# Altium schematic sheet 03-TESTER_CONFIG.SchDoc
size 594 x 420 mm
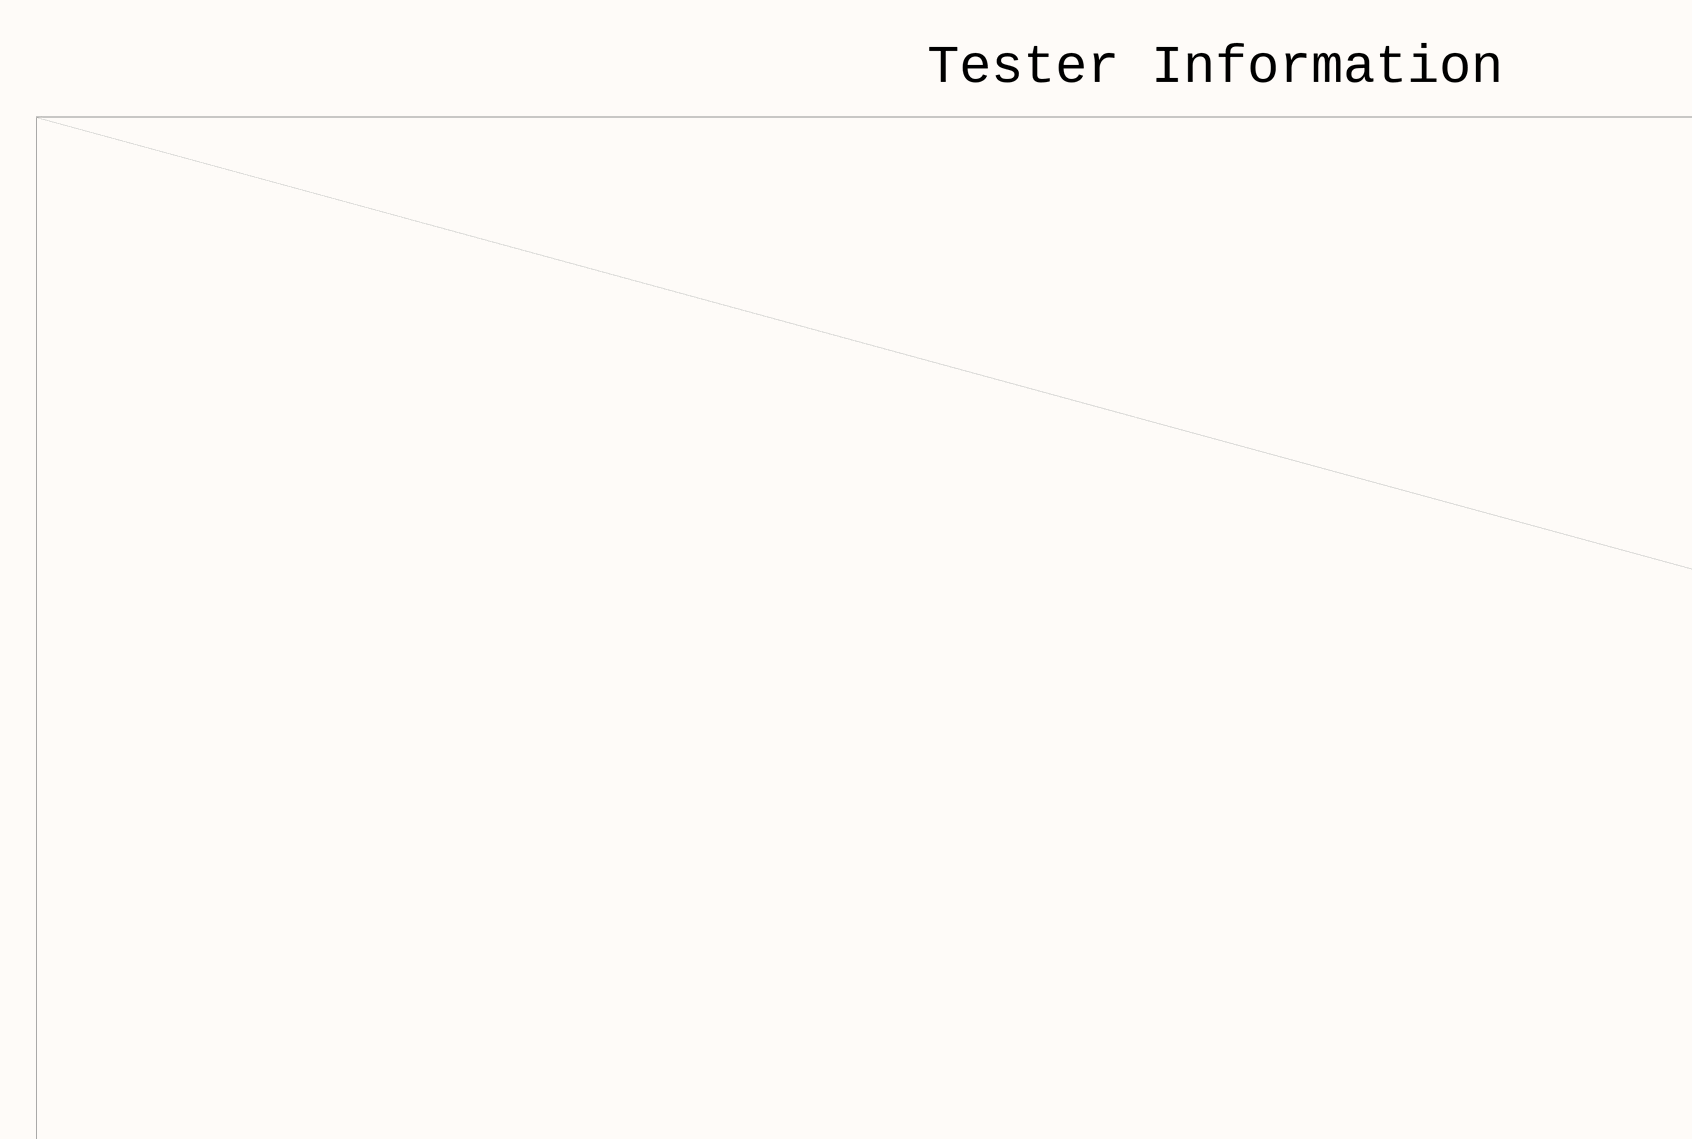
[diagram p0: 03-TESTER_CONFIG.SchDoc, top column 1 of 4]
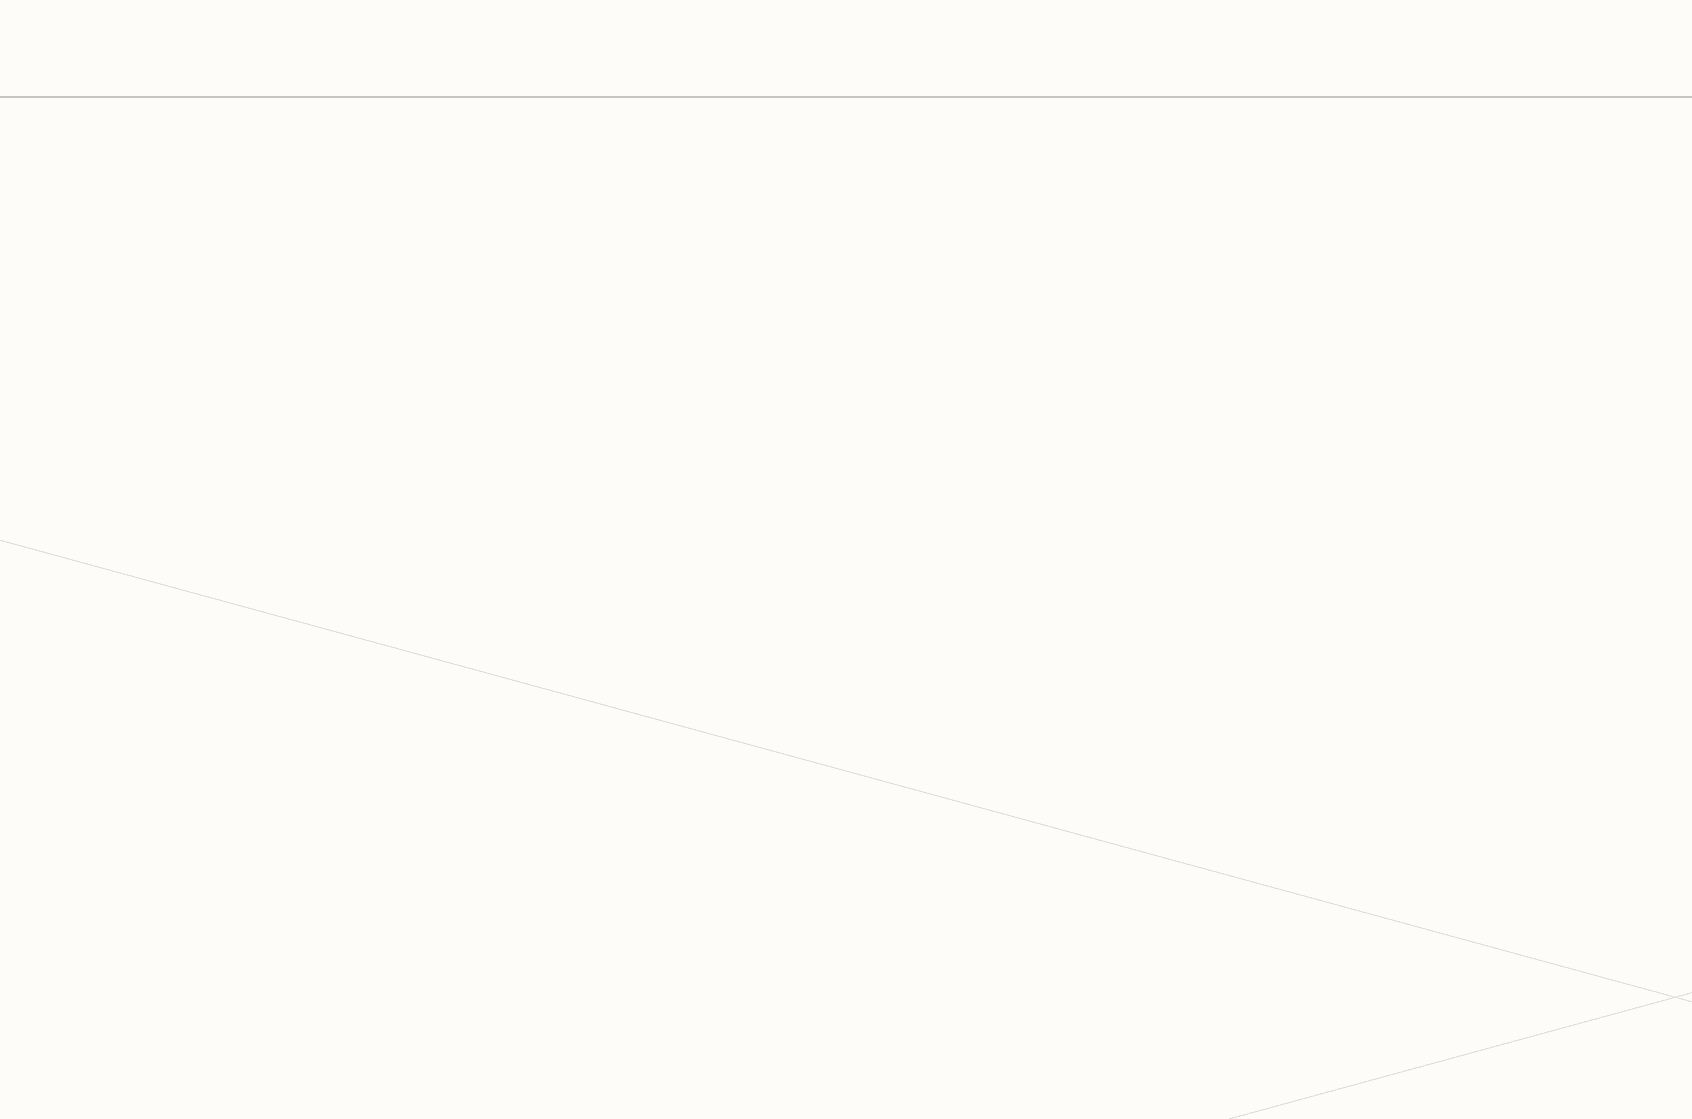
[diagram p1: 03-TESTER_CONFIG.SchDoc, top column 2 of 4]
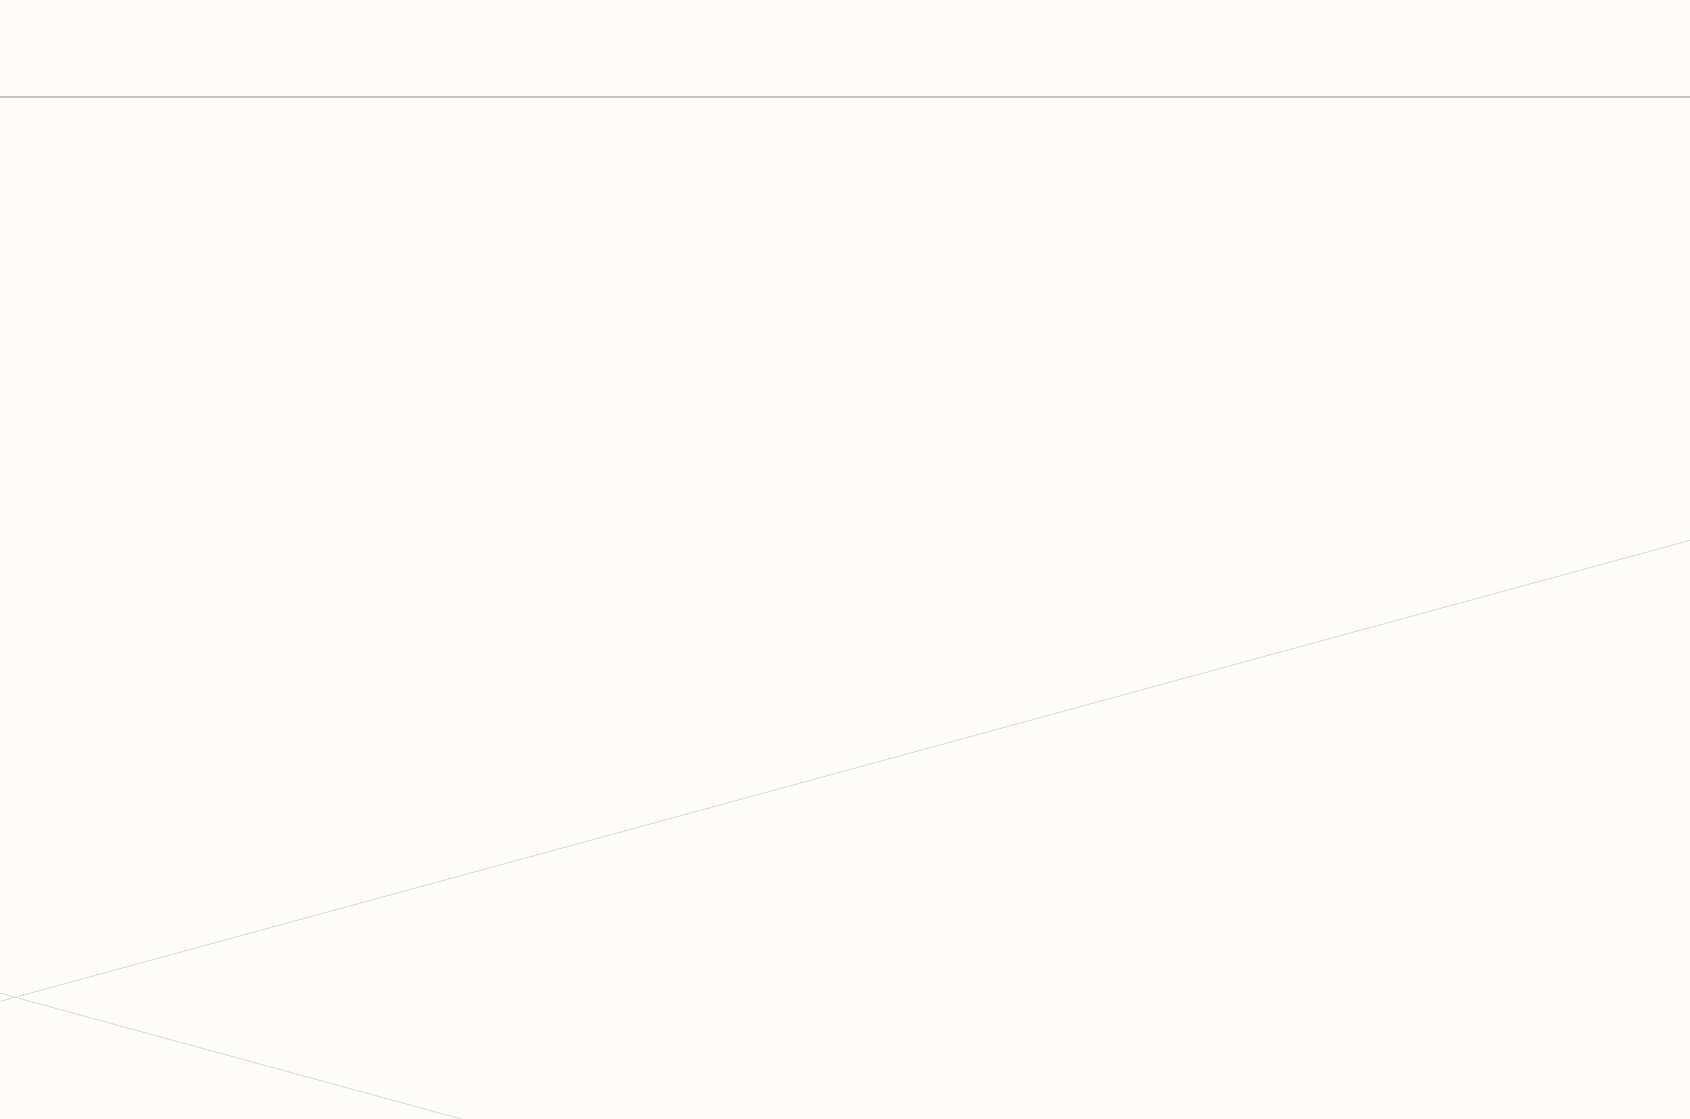
[diagram p2: 03-TESTER_CONFIG.SchDoc, top column 3 of 4]
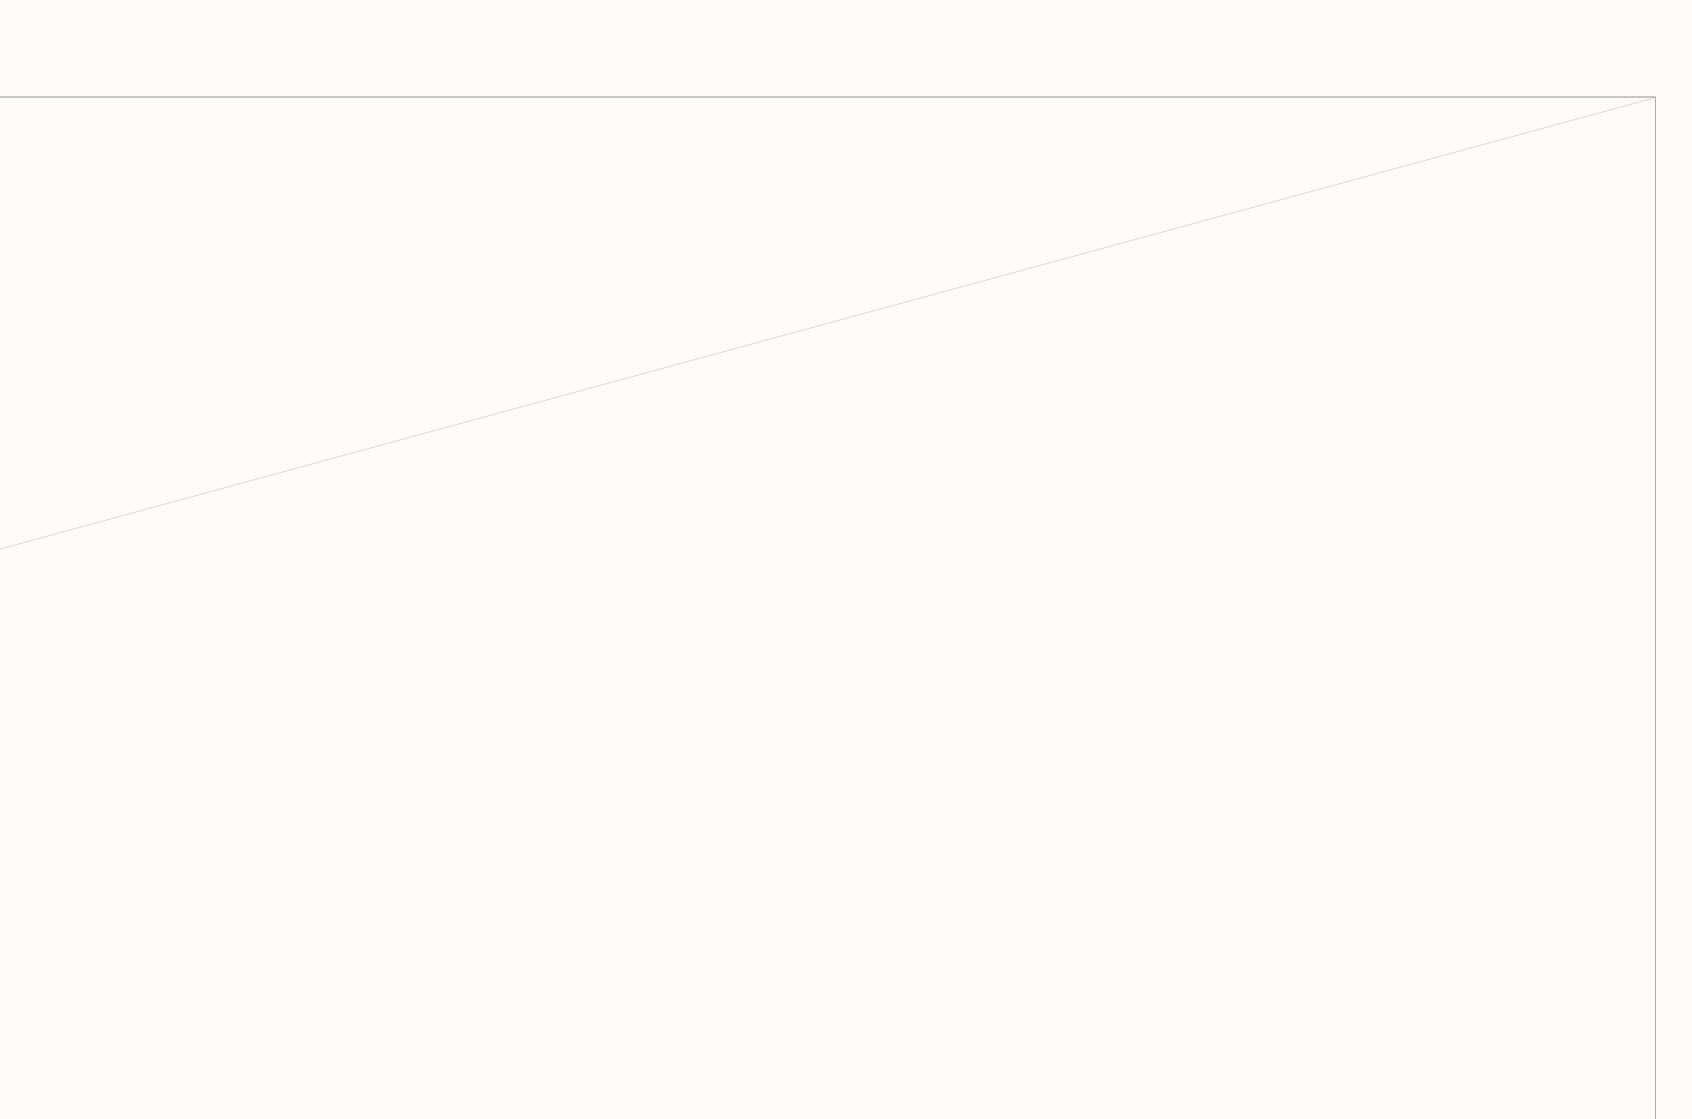
[diagram p3: 03-TESTER_CONFIG.SchDoc, top column 4 of 4]
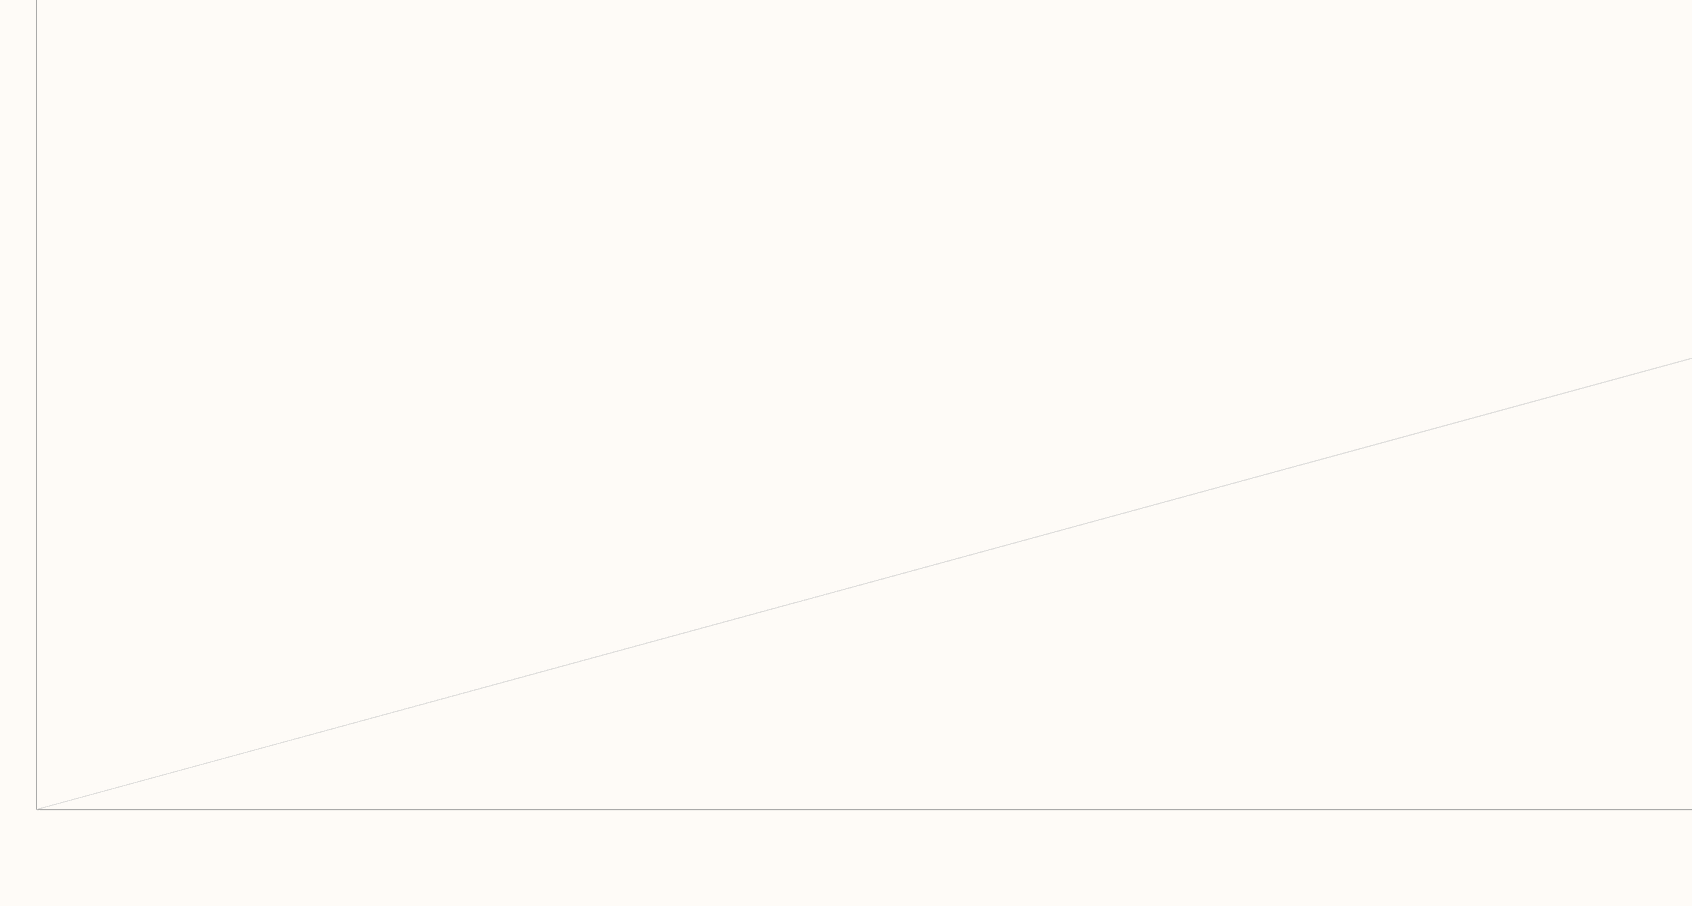
[diagram p4: 03-TESTER_CONFIG.SchDoc, bottom column 1 of 4]
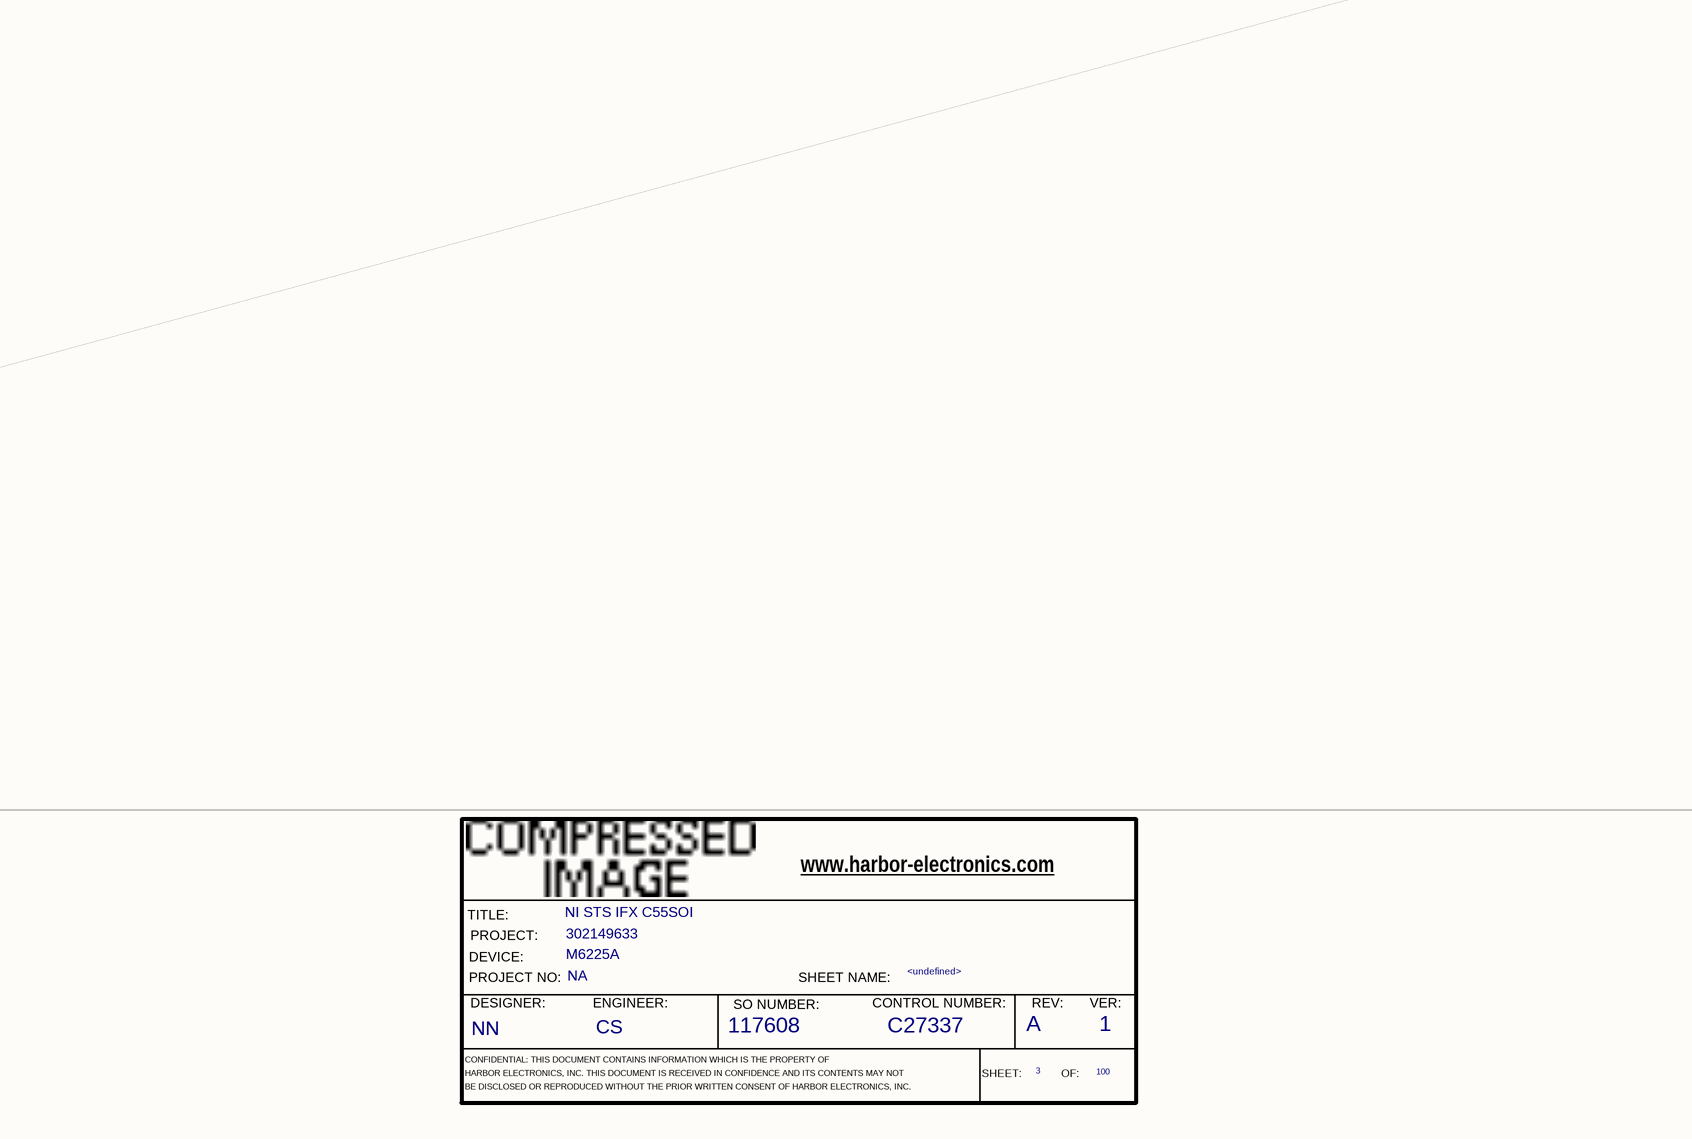
[diagram p5: 03-TESTER_CONFIG.SchDoc, bottom column 2 of 4]
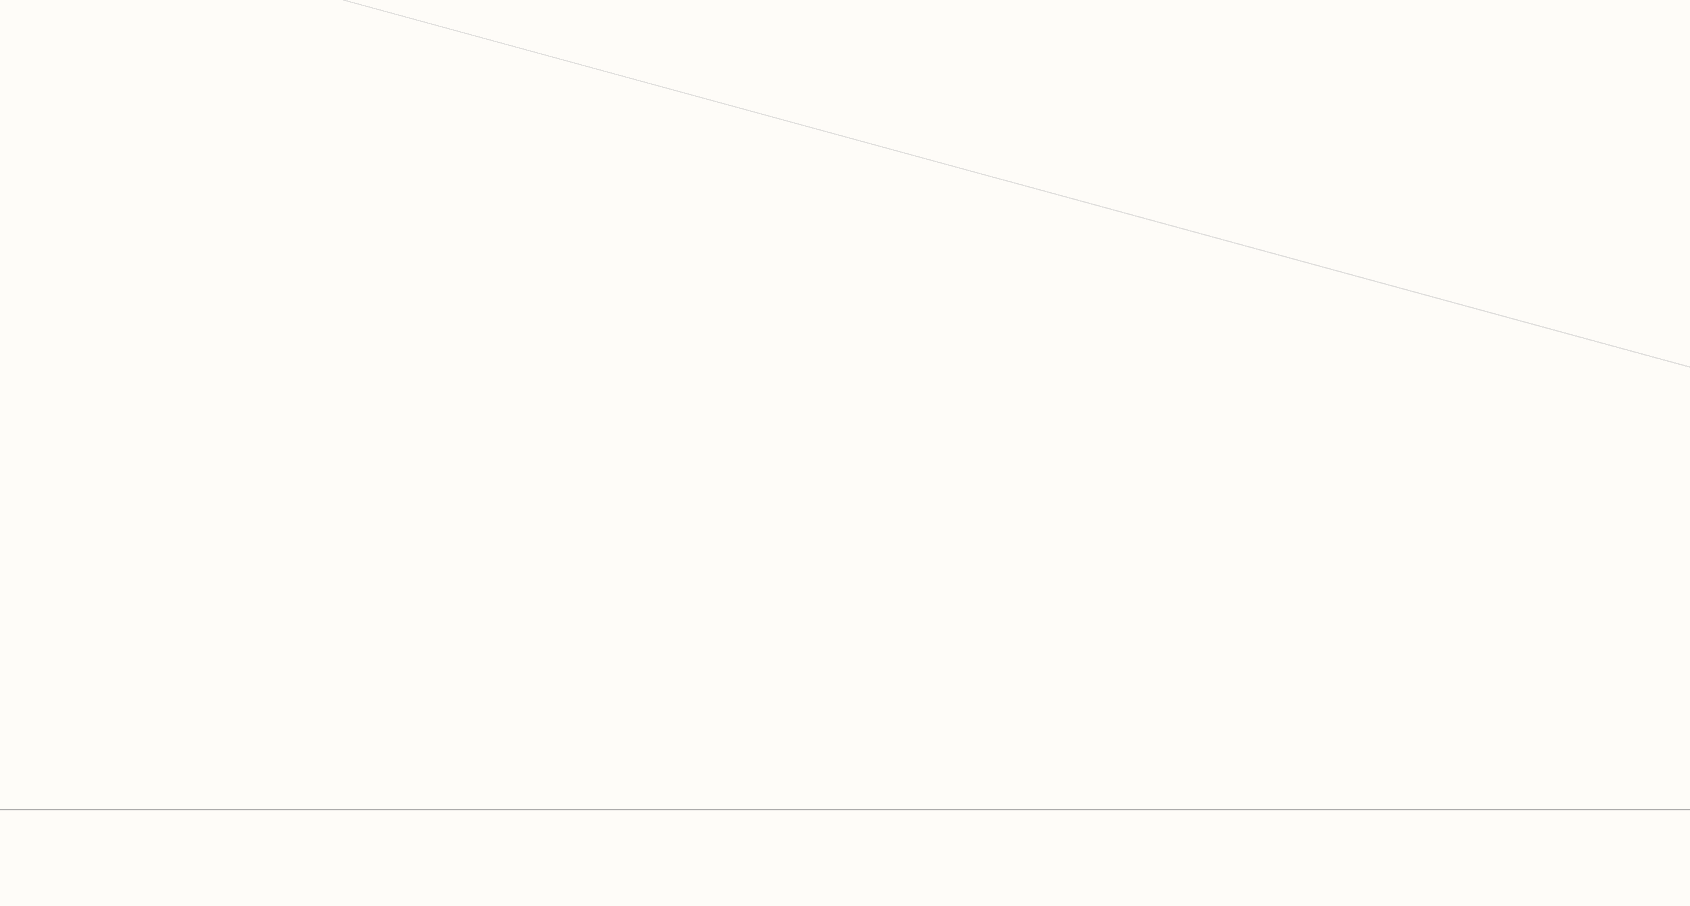
[diagram p6: 03-TESTER_CONFIG.SchDoc, bottom column 3 of 4]
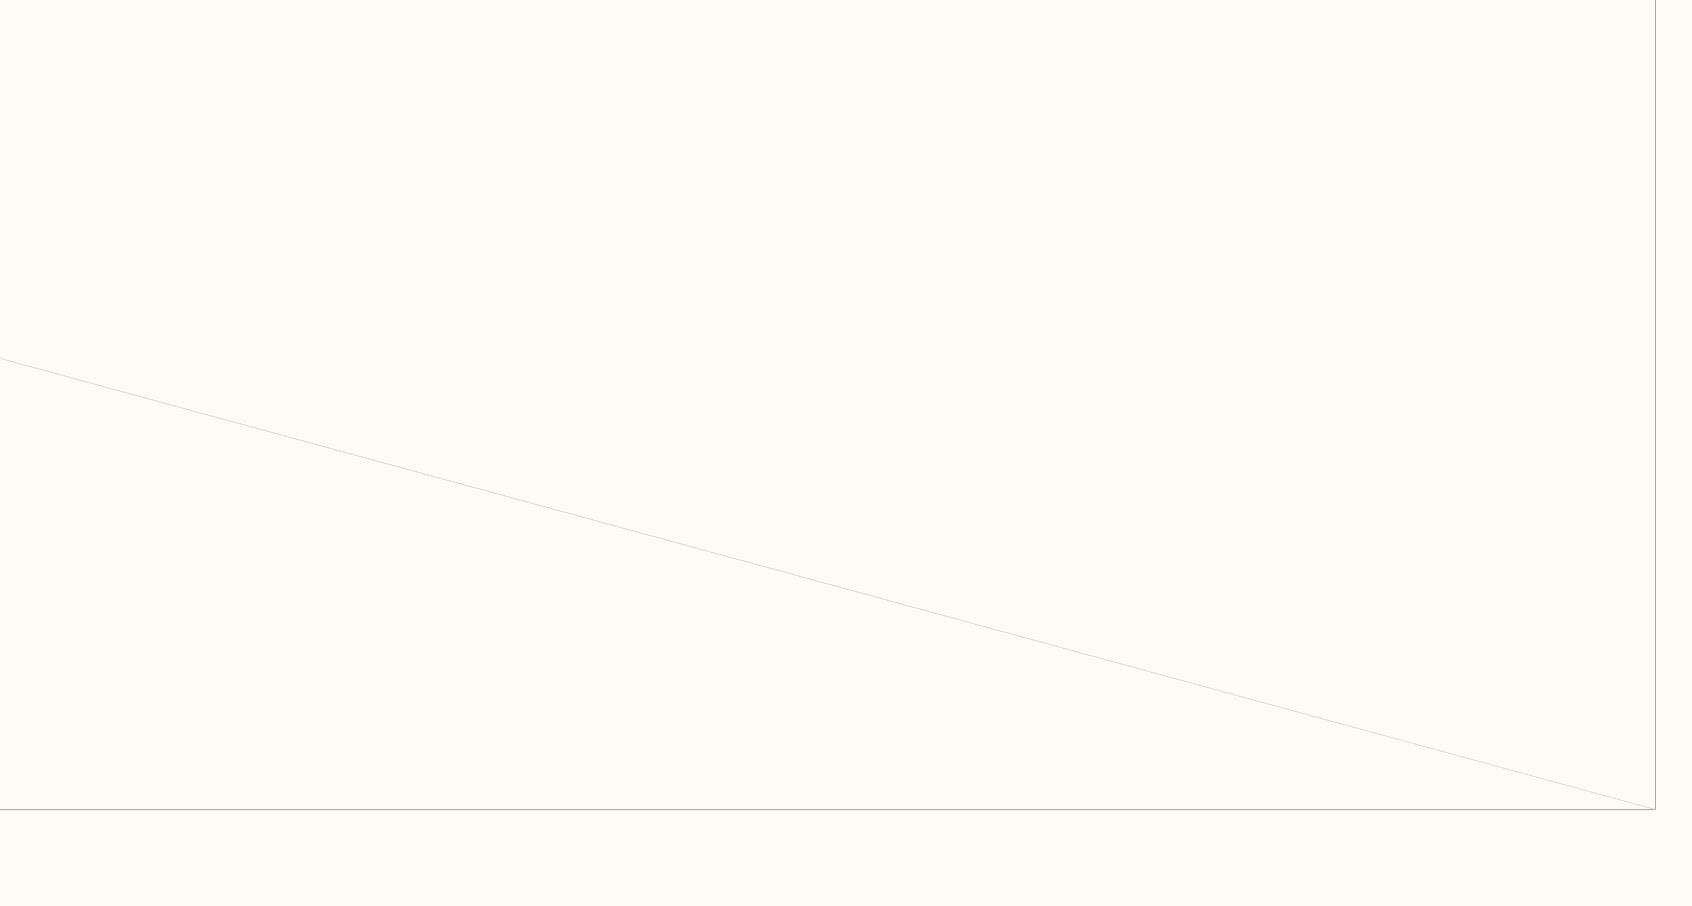
[diagram p7: 03-TESTER_CONFIG.SchDoc, bottom column 4 of 4]

## Parts
*  RevCode: A  Title: NI STS IFX C55SOI  Page Number: 3  Page Count: 100  Engineer: CS  Designer: NN  SO Number: 117608  Control Number: C27337  Version: 1  Page Name: <undefined>  PROJECT: 302149633  DEVICE: M6225A  PROJECT NO.: NA  (hidden comment: HE_DEFAULT)  (graphical)

## Notes on the sheet
- Tester Information
- (in symbol HE_DEFAULT) www.harbor-electronics.com; TITLE:; PROJECT:; DEVICE:; PROJECT NO:; SHEET NAME:; DESIGNER:; ENGINEER:; SO NUMBER:; CONTROL NUMBER:; REV:; VER:; CONFIDENTIAL: THIS DOCUMENT CONTAINS INFORMATION WHICH IS THE PROPERTY OF; HARBOR ELECTRONICS, INC. THIS DOCUMENT IS RECEIVED IN CONFIDENCE AND ITS CONTENTS MAY NOT; SHEET:; OF:; BE DISCLOSED OR REPRODUCED WITHOUT THE PRIOR WRITTEN CONSENT OF HARBOR ELECTRONICS, INC.

## Library data of the parts
* = HE_DEFAULT: Page Size: X; OrgAddr4: Fax: +1 602-431-9633; OrgAddr1: 4050 E. Cotton Center Blvd., Suite 33; OrgAddr2: Phoenix, Arizona 85040 U.S.A.; OrgAddr3: Phone: +1 602-438-1112; Doc: <Title Name>; OrgName: HARBOR